# EasyEDA schematic Esquema_Nano-Osciloscopio-ATmega328P.json
TITLE: Nano Osciloscopio para ATmega328P; REV: Nano; Date: 2026-09-25; Sheet: 1/1; Company: @alecelular
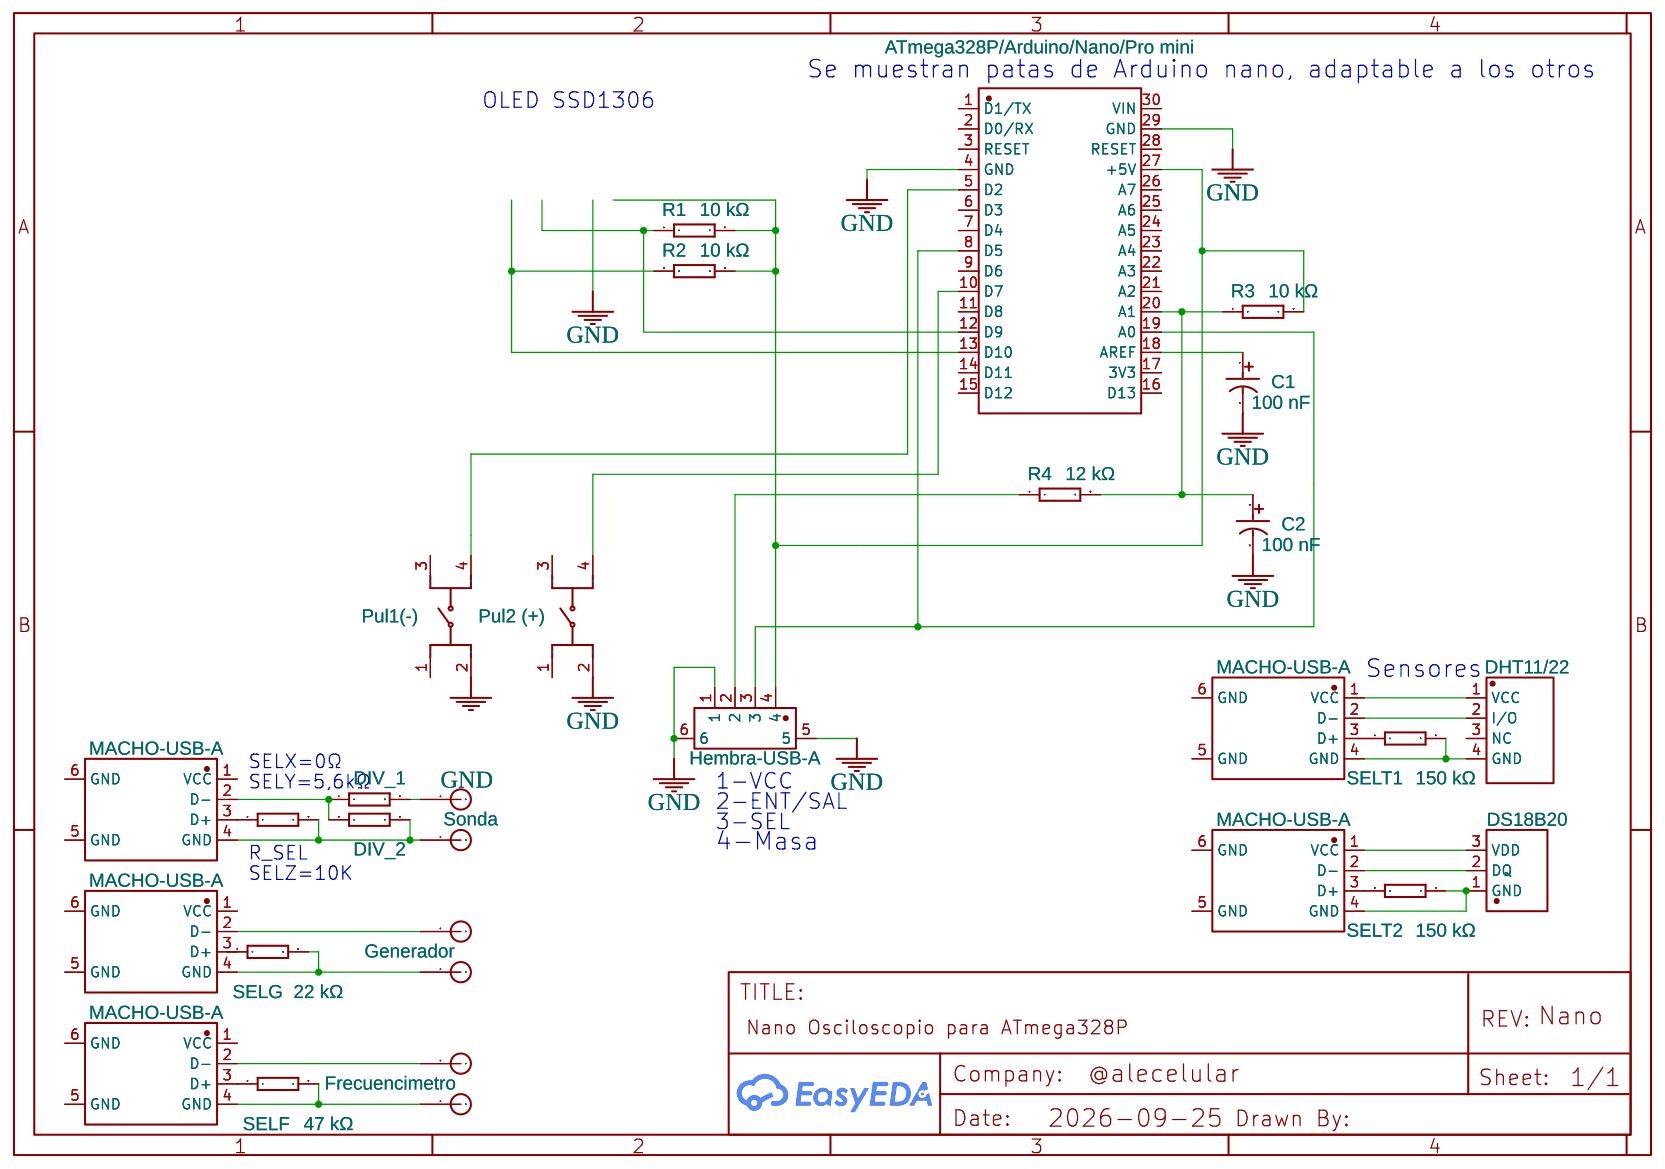
[diagram p0: schematic sheet]

## Parts
C1  100 nF  [100UF CAPACITOR, 2.54MM PIN CAPACITOR]
C2  100 nF  [100UF CAPACITOR, 2.54MM PIN CAPACITOR]
DIV_1  3,9 kΩ  [R1206]
DIV_2  3,9 kΩ  [R1206]
MACHO-USB-A  USB-ZD-136DIP  [USB-A-TH_USB-ZD-136DIP]
MACHO-USB-A#2  USB-ZD-136DIP  [USB-A-TH_USB-ZD-136DIP]
MACHO-USB-A#3  USB-ZD-136DIP  [USB-A-TH_USB-ZD-136DIP]
MACHO-USB-A#4  USB-ZD-136DIP  [USB-A-TH_USB-ZD-136DIP]
MACHO-USB-A#5  USB-ZD-136DIP  [USB-A-TH_USB-ZD-136DIP]
OPCIONAL  DHT11/22  [SENSOR-TH_DHT11-1]
R1  10 kΩ  [R1206]
R2  10 kΩ  [R1206]
R3  10 kΩ  [R1206]
R4  12 kΩ  [R1206]
SELF  47 kΩ  [R1206]
SELG  22 kΩ  [R1206]
SELT1  150 kΩ  [R1206]
SELT2  150 kΩ  [R1206]
SELY=3,9K  3,9 kΩ  [R1206]
U2  Pul1(-)  [PULSADOR]
U3  Hembra-USB-A  [USB-A-TH_USB-A-DIP_USB-234-BCW]
U4  DS18B20  [TO-92-3_L4.9-W3.7-P2.54-L]
U5  Pul2 (+)  [PULSADOR]
U6  Sonda
U10  TP_N
U11  Generador
U12  TP_N
U13  TP_N
U14  Frecuencimetro
U15  ATmega328P/Arduino/Nano/Pro mini  [COMM-TH_ARDUINO_NANO]

## Library data of the parts
C1 C2 = CAPACITOR COPY: Manufacturer: CX(承兴); Manufacturer Part: KM476M016D11RR0VH2FP0; JLCPCB Part Class: Extended Part; Contributor: Hacket
DIV_1 DIV_2 R1-R4 SELF SELG SELT1 SELT2 SELY=3,9K = RESISTOR: Contributor: DangerousPrototype
MACHO-USB-A MACHO-USB-A#2-MACHO-USB-A#5 = USB-ZD-136DIP: Supplier: LCSC; Supplier Part: C5273997; Manufacturer: HDGC(华德共创); Contributor: lcsc; JLCPCB Part Class: Extended Part
OPCIONAL = DHT11_C87032: Supplier Part: C87032; Supplier: LCSC; Manufacturer: AOSONG; Manufacturer Part: DHT11; JLCPCB Part Class: Extended Part
U2 U5 = MINIPULSADOR: Supplier: Add New Supplier; Contributor: ANGEL3
U3 = USB-A-DIP_USB-234-BCW: Supplier: LCSC; Supplier Part: C9900005365; Manufacturer: null; Contributor: lcsc; JLCPCB Part Class: Extended Part
U4 = DS18B20+T&amp;R: Contributor: LCSC; Supplier: LCSC; Supplier Part: C880672; Manufacturer: ADI(亚德诺)/MAXIM(美信); Manufacturer Part: DS18B20+T&R; JLCPCB Part Class: Extended Part
U6 U11 U14 = TP_P: Contributor: aiglesias
U10 U12 U13 = TP_N: Contributor: aiglesias
U15 = ARDUINO_NANO: Contributor: lcsc; Supplier: LCSC; Supplier Part: C9900017879; Manufacturer: null; JLCPCB Part Class: Extended Part

## Nets
GND: C1.2 C2.2 U2.2 U3.1 U3.5 U3.6 U5.2 U15.4(GND) U15.29(GND)
Net-(C1-1): C1.1 U15.18(AREF)
Net-(C2-1): C2.1 R3.1 R4.2 U15.20(A1)
Net-(DIV_1-1): DIV_1.1 DIV_2.1 MACHO-USB-A#3.2(D-)
Net-(DIV_1-2): DIV_1.2 U6.1
Net-(DIV_2-2): DIV_2.2 MACHO-USB-A#3.4(GND) SELY=3,9K.2 U10.1
Net-(MACHO-USB-A#2-1): MACHO-USB-A#2.1(VCC) U4.3(VDD)
Net-(MACHO-USB-A#2-2): MACHO-USB-A#2.2(D-) U4.2(DQ)
Net-(MACHO-USB-A#2-3): MACHO-USB-A#2.3(D+) SELT2.1
Net-(MACHO-USB-A#2-4): MACHO-USB-A#2.4(GND) SELT2.2 U4.1(GND)
Net-(MACHO-USB-A#3-3): MACHO-USB-A#3.3(D+) SELY=3,9K.1
Net-(MACHO-USB-A#4-2): MACHO-USB-A#4.2(D-) U11.1
Net-(MACHO-USB-A#4-4): MACHO-USB-A#4.4(GND) SELG.2 U12.1
Net-(MACHO-USB-A#5-2): MACHO-USB-A#5.2(D-) U14.1
Net-(MACHO-USB-A#5-3): MACHO-USB-A#5.3(D+) SELF.1
Net-(MACHO-USB-A#5-4): MACHO-USB-A#5.4(GND) SELF.2 U13.1
Net-(MACHO-USB-A-1): MACHO-USB-A.1(VCC) OPCIONAL.1(VCC)
Net-(MACHO-USB-A-2): MACHO-USB-A.2(D-) OPCIONAL.2(I/O)
Net-(MACHO-USB-A-3): MACHO-USB-A.3(D+) SELT1.1
Net-(MACHO-USB-A-4): MACHO-USB-A.4(GND) OPCIONAL.4(GND) SELT1.2
Net-(R1-1): R1.1 U15.12(D9)
Net-(R1-2): R1.2 R2.2 R3.2 U3.4 U15.27(+5V)
Net-(R2-1): R2.1 U15.13(D10)
Net-(R4-1): R4.1 U3.2
Net-(U2-4): U2.4 U15.5(D2)
Net-(U3-3): U3.3 U15.8(D5) U15.19(A0)
Net-(U5-4): U5.4 U15.10(D7)

Not connected (* = marked no-connect by the designer): MACHO-USB-A 5(GND) 6(GND); MACHO-USB-A#2 5(GND) 6(GND); MACHO-USB-A#3 1(VCC) 5(GND) 6(GND); MACHO-USB-A#4 1(VCC) 3(D+) 5(GND) 6(GND); MACHO-USB-A#5 1(VCC) 5(GND) 6(GND); OPCIONAL 3(NC); SELG 1; U2 1 3; U5 1 3; U15 1(D1/TX) 2(D0/RX) 3(RESET) 6(D3) 7(D4) 9(D6) 11(D8) 14(D11) 15(D12) 16(D13) 17(3V3) 21(A2) 22(A3) 23(A4) 24(A5) 25(A6) 26(A7) 28(RESET) 30(VIN)

## Notes on the sheet
- Se muestran patas de Arduino nano, adaptable a los otros
- OLED SSD1306
- Sensores
- SELX=0Ω
- SELY=5,6kΩ
- 1-VCC
- 2-ENT/SAL
- 3-SEL
- 4-Masa
- R_SEL
- SELZ=10K
